# EAGLE design attiny85-5x5x5LEDCube (EAGLE 5.11)
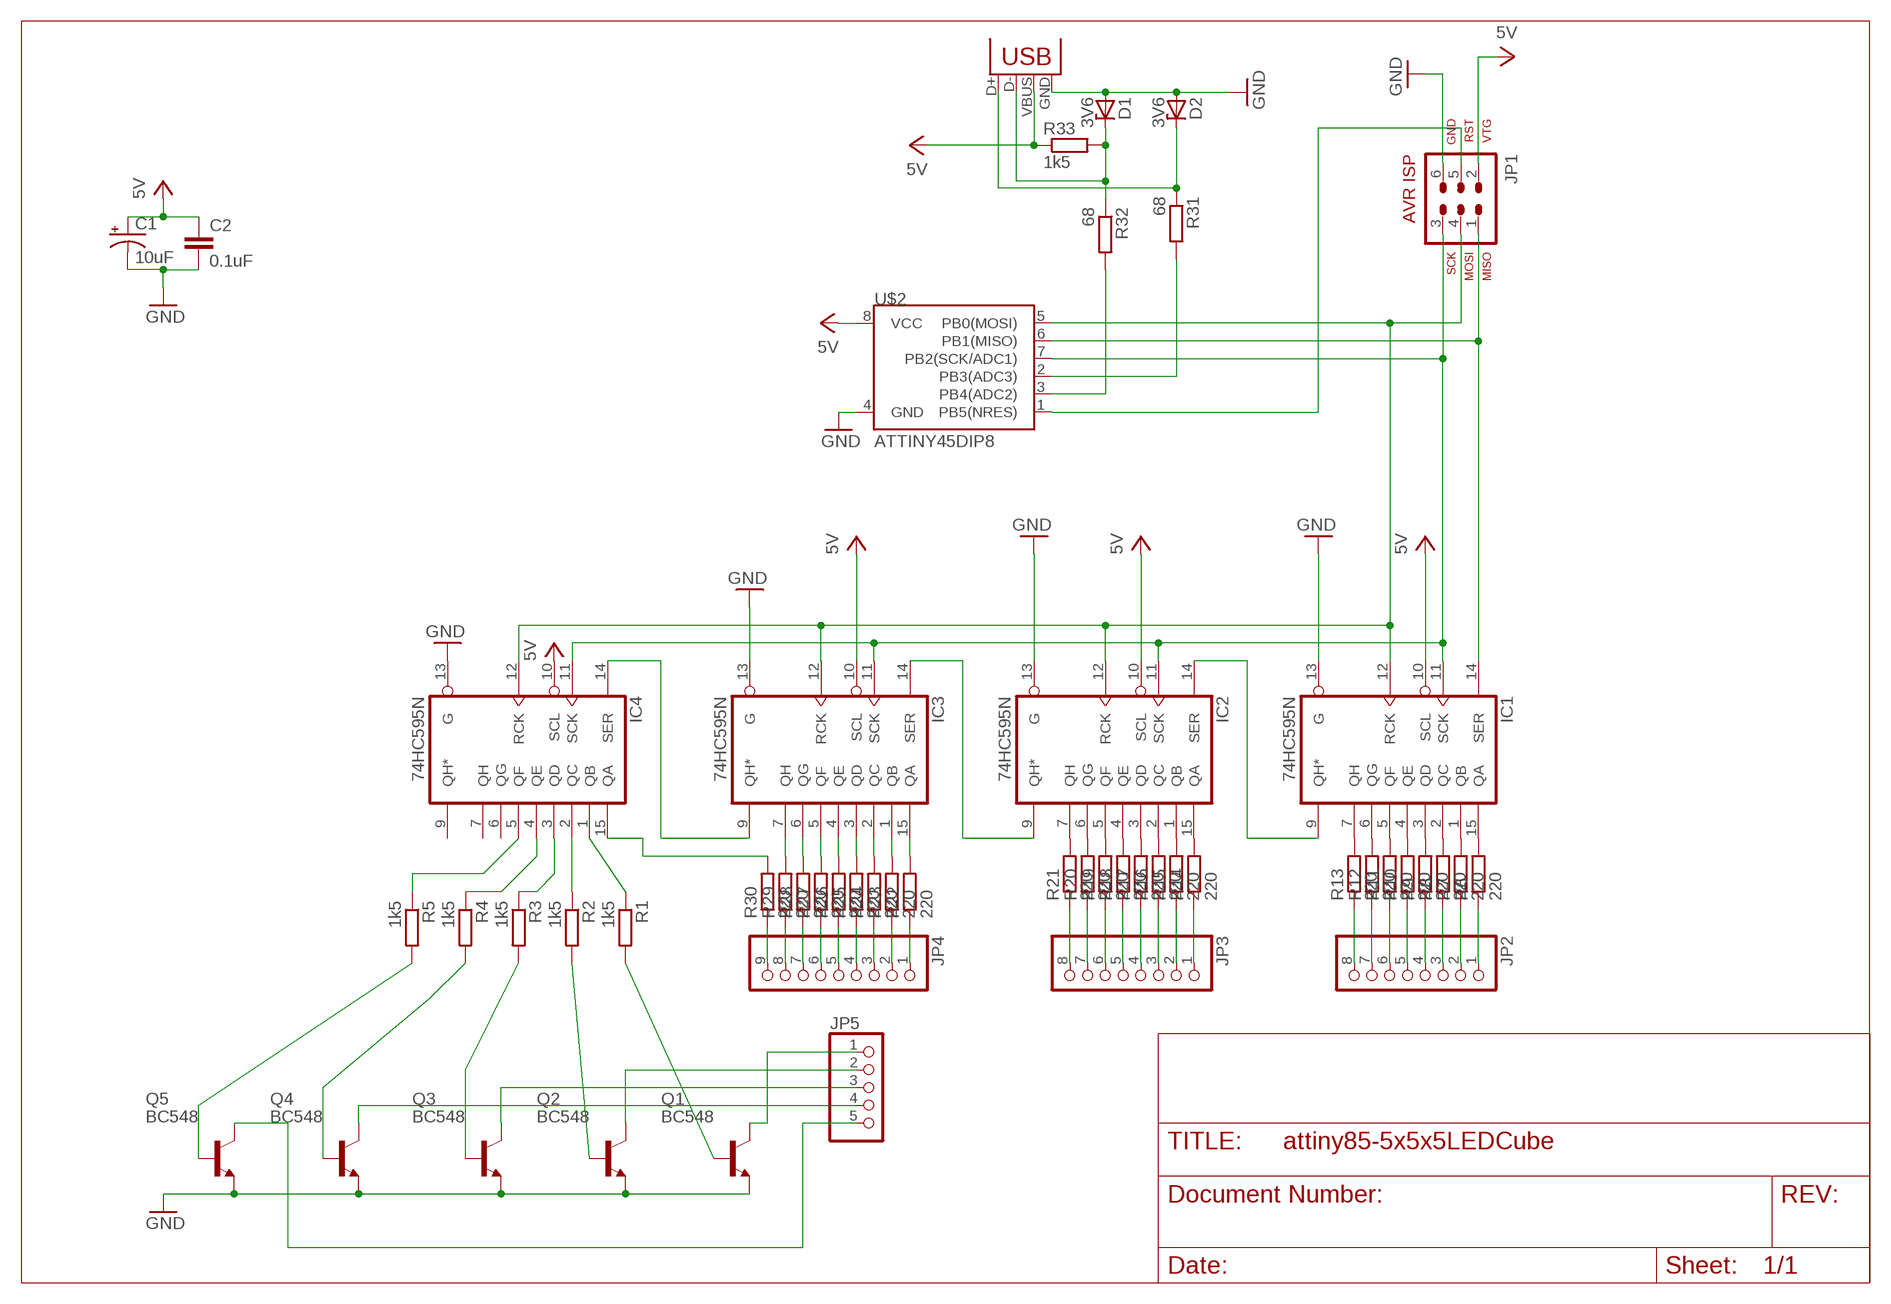
[diagram p0: schematic, sheet 1]

## Parts
C1  10uF  CAP_POLPTH2  [CPOL-RADIAL-10UF-25V]
C2  0.1uF  C-EU050-024X044  [C050-024X044]
D1  3V6  ZENER-DIODEDO34-7  [DO34Z7]
D2  3V6  ZENER-DIODEDO34-7  [DO34Z7]
IC1  74HC595N  [DIL16]
IC2  74HC595N  [DIL16]
IC3  74HC595N  [DIL16]
IC4  74HC595N  [DIL16]
JP1  AVR-ISP-6  [AVR-ISP-6]
JP2  PINHD-1X8  [1X08]
JP3  PINHD-1X8  [1X08]
JP4  PINHD-1X9  [1X09]
JP5  PINHD-1X5  [1X05]
Q1  BC548  [TO92-EBC]
Q2  BC548  [TO92-EBC]
Q3  BC548  [TO92-EBC]
Q4  BC548  [TO92-EBC]
Q5  BC548  [TO92-EBC]
R1  1k5  R-EU_0207/7  [0207/7]
R2  1k5  R-EU_0207/7  [0207/7]
R3  1k5  R-EU_0207/7  [0207/7]
R4  1k5  R-EU_0207/7  [0207/7]
R5  1k5  R-EU_0207/7  [0207/7]
R6  220  R-EU_0207/7  [0207/7]
R7  220  R-EU_0207/7  [0207/7]
R8  220  R-EU_0207/7  [0207/7]
R9  220  R-EU_0207/7  [0207/7]
R10  220  R-EU_0207/7  [0207/7]
R11  220  R-EU_0207/7  [0207/7]
R12  220  R-EU_0207/7  [0207/7]
R13  220  R-EU_0207/7  [0207/7]
R14  220  R-EU_0207/7  [0207/7]
R15  220  R-EU_0207/7  [0207/7]
R16  220  R-EU_0207/7  [0207/7]
R17  220  R-EU_0207/7  [0207/7]
R18  220  R-EU_0207/7  [0207/7]
R19  220  R-EU_0207/7  [0207/7]
R20  220  R-EU_0207/7  [0207/7]
R21  220  R-EU_0207/7  [0207/7]
R22  220  R-EU_0207/7  [0207/7]
R23  220  R-EU_0207/7  [0207/7]
R24  220  R-EU_0207/7  [0207/7]
R25  220  R-EU_0207/7  [0207/7]
R26  220  R-EU_0207/7  [0207/7]
R27  220  R-EU_0207/7  [0207/7]
R28  220  R-EU_0207/7  [0207/7]
R29  220  R-EU_0207/7  [0207/7]
R30  220  R-EU_0207/7  [0207/7]
R31  68  R-EU_0207/7  [0207/7]
R32  68  R-EU_0207/7  [0207/7]
R33  1k5  R-EU_0207/7  [0207/7]
U$2  ATTINY45DIP8  [DIP08]
X1  USBPTH  [USB-B-PTH]

## Nets
GND: C1.2(-) C2.2 D1.A D2.A IC1.13(G) IC2.13(G) IC3.13(G) IC4.13(G) JP1.6 Q1.E Q2.E Q3.E Q4.E Q5.E U$2.4(GND) X1.GND
N$1: Q1.B R1.2
N$2: Q2.B R2.2
N$3: IC4.2(QC) R2.1
N$4: Q3.B R3.2
N$5: Q4.B R4.2
N$6: IC1.15(QA) R6.2
N$7: IC1.1(QB) R7.2
N$8: IC1.2(QC) R8.2
N$9: IC1.3(QD) R9.2
N$10: IC1.4(QE) R10.2
N$11: IC1.5(QF) R11.2
N$12: IC1.6(QG) R12.2
N$13: IC1.7(QH) R13.2
N$14: IC1.12(RCK) IC2.12(RCK) IC3.12(RCK) IC4.12(RCK) JP1.4 U$2.5(PB0(MOSI))
N$15: IC1.14(SER) JP1.1 U$2.6(PB1(MISO))
N$16: IC1.11(SCK) IC2.11(SCK) IC3.11(SCK) IC4.11(SCK) JP1.3 U$2.7(PB2(SCK/ADC1))
N$17: IC2.15(QA) R14.2
N$18: IC2.1(QB) R15.2
N$19: IC2.2(QC) R16.2
N$20: IC2.3(QD) R17.2
N$21: IC2.4(QE) R18.2
N$22: IC2.5(QF) R19.2
N$23: IC2.6(QG) R20.2
N$24: IC2.7(QH) R21.2
N$25: IC3.15(QA) R22.2
N$26: IC3.1(QB) R23.2
N$27: IC3.2(QC) R24.2
N$28: IC3.3(QD) R25.2
N$29: IC3.4(QE) R26.2
N$30: IC3.5(QF) R27.2
N$31: IC3.6(QG) R28.2
N$32: IC3.7(QH) R29.2
N$33: IC4.15(QA) R30.2
N$34: IC1.9(QH*) IC2.14(SER)
N$35: IC2.9(QH*) IC3.14(SER)
N$36: IC3.9(QH*) IC4.14(SER)
N$37: IC4.1(QB) R1.1
N$38: Q5.B R5.2
N$39: IC4.3(QD) R3.1
N$40: IC4.4(QE) R4.1
N$41: IC4.5(QF) R5.1
N$42: JP2.1 R6.1
N$43: R31.2 U$2.2(PB3(ADC3))
N$44: D1.C R32.1 R33.2 X1.D-
N$45: D2.C R31.1 X1.D+
N$46: R32.2 U$2.3(PB4(ADC2))
N$47: JP2.2 R7.1
N$48: JP2.3 R8.1
N$49: JP2.4 R9.1
N$50: JP2.5 R10.1
N$51: JP2.8 R13.1
N$52: JP2.7 R12.1
N$53: JP3.1 R14.1
N$54: JP3.2 R15.1
N$55: JP3.3 R16.1
N$56: JP3.4 R17.1
N$57: JP3.5 R18.1
N$58: JP3.6 R19.1
N$59: JP3.7 R20.1
N$60: JP3.8 R21.1
N$61: JP4.1 R22.1
N$62: JP4.2 R23.1
N$63: JP4.3 R24.1
N$64: JP4.5 R26.1
N$65: JP4.6 R27.1
N$66: JP4.7 R28.1
N$67: JP4.8 R29.1
N$68: JP4.9 R30.1
N$69: JP5.1 Q1.C
N$70: JP5.2 Q2.C
N$71: JP5.3 Q3.C
N$72: JP5.4 Q4.C
N$73: JP5.5 Q5.C
N$74: JP4.4 R25.1
N$75: JP2.6 R11.1
N$76: JP1.5 U$2.1(PB5(NRES))
VCC: C1.1(+) C2.1 IC1.10(SCL) IC2.10(SCL) IC3.10(SCL) IC4.10(SCL) JP1.2 R33.1 U$2.8(VCC) X1.VBUS ; supply symbol labelled 5V
Unconnected: IC4.6(QG) IC4.7(QH) IC4.9(QH*)

## Power pins joined to a net without a drawn wire
GND: IC1.8(GND) IC2.8(GND) IC3.8(GND) IC4.8(GND)
VCC: IC1.16(VCC) IC2.16(VCC) IC3.16(VCC) IC4.16(VCC)

## Library data of the parts
C1 = SparkFun:CAP_POL: Capacitor Polarized These are standard SMD and PTH capacitors. Normally 10uF, 47uF, and 100uF in electrolytic and tantalum varieties. Always verify the external diameter of the through hole cap, it varies with capacity, voltage, and manufacturer. The EIA devices should be standard.
C2 = resistor:C-EU: CAPACITOR, European symbol
D1 D2 = diode:ZENER-DIODE: Z-Diode
IC1-IC4 = 74xx-eu:74*595: 8-bit SHIFT REGISTER, output latch
JP1 = avr-6:AVR-ISP-6: AVR ISP-6 Serial Programming Header
JP2 JP3 = pinhead:PINHD-1X8: PIN HEADER
JP4 = pinhead:PINHD-1X9: PIN HEADER
JP5 = pinhead:PINHD-1X5: PIN HEADER
Q1-Q5 = transistor-npn:BC548*: NPN Transistor
R1-R33 = resistor:R-EU_: RESISTOR, European symbol
U$2 = SparkFun:ATTINY45: Atmel ATTiny45
X1 = SparkFun:USB: USB Connectors USB-B-PTH is fully proven SKU : PRT-00139 USB-miniB is fully proven SKU : PRT-00587 USB-A-PCB is untested. USB-A-H is throughly reviewed, but untested. Spark Fun Electronics SKU : PRT-00437 USB-B-SMT is throughly reviewed, but untested. Needs silkscreen touching up. USB-A-S has not been used/tested USB-MB-H has not been used/tested

## Board
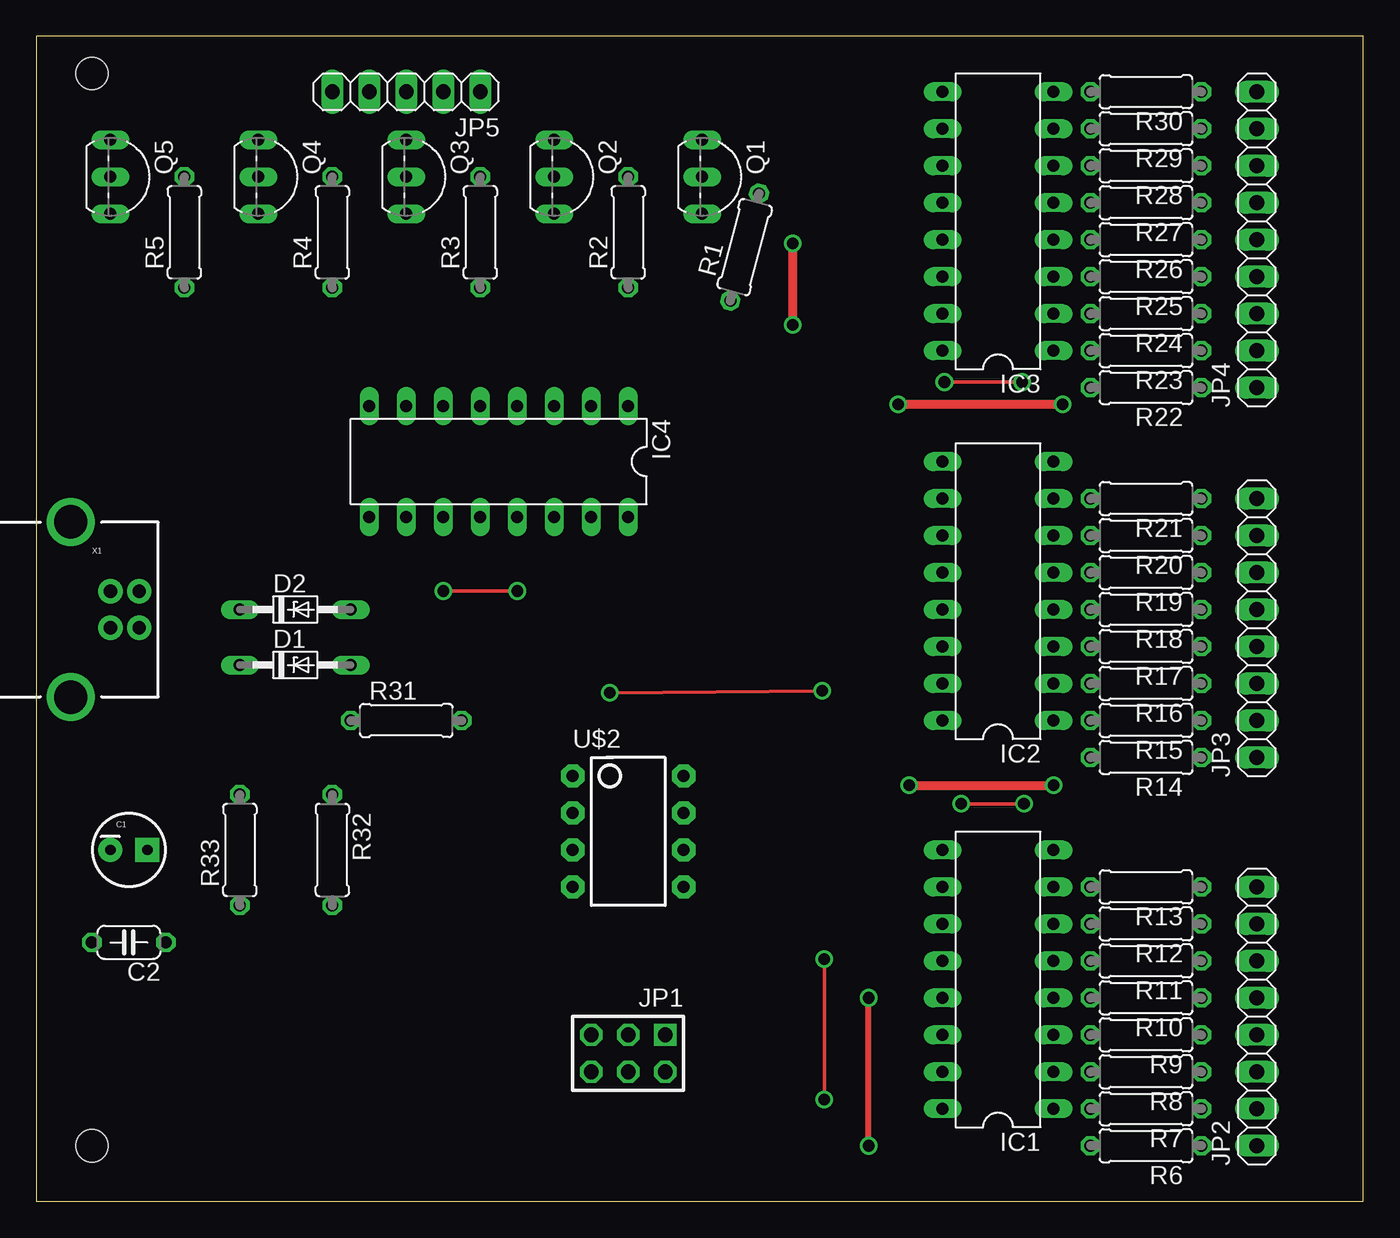
[diagram p1: board, top side]
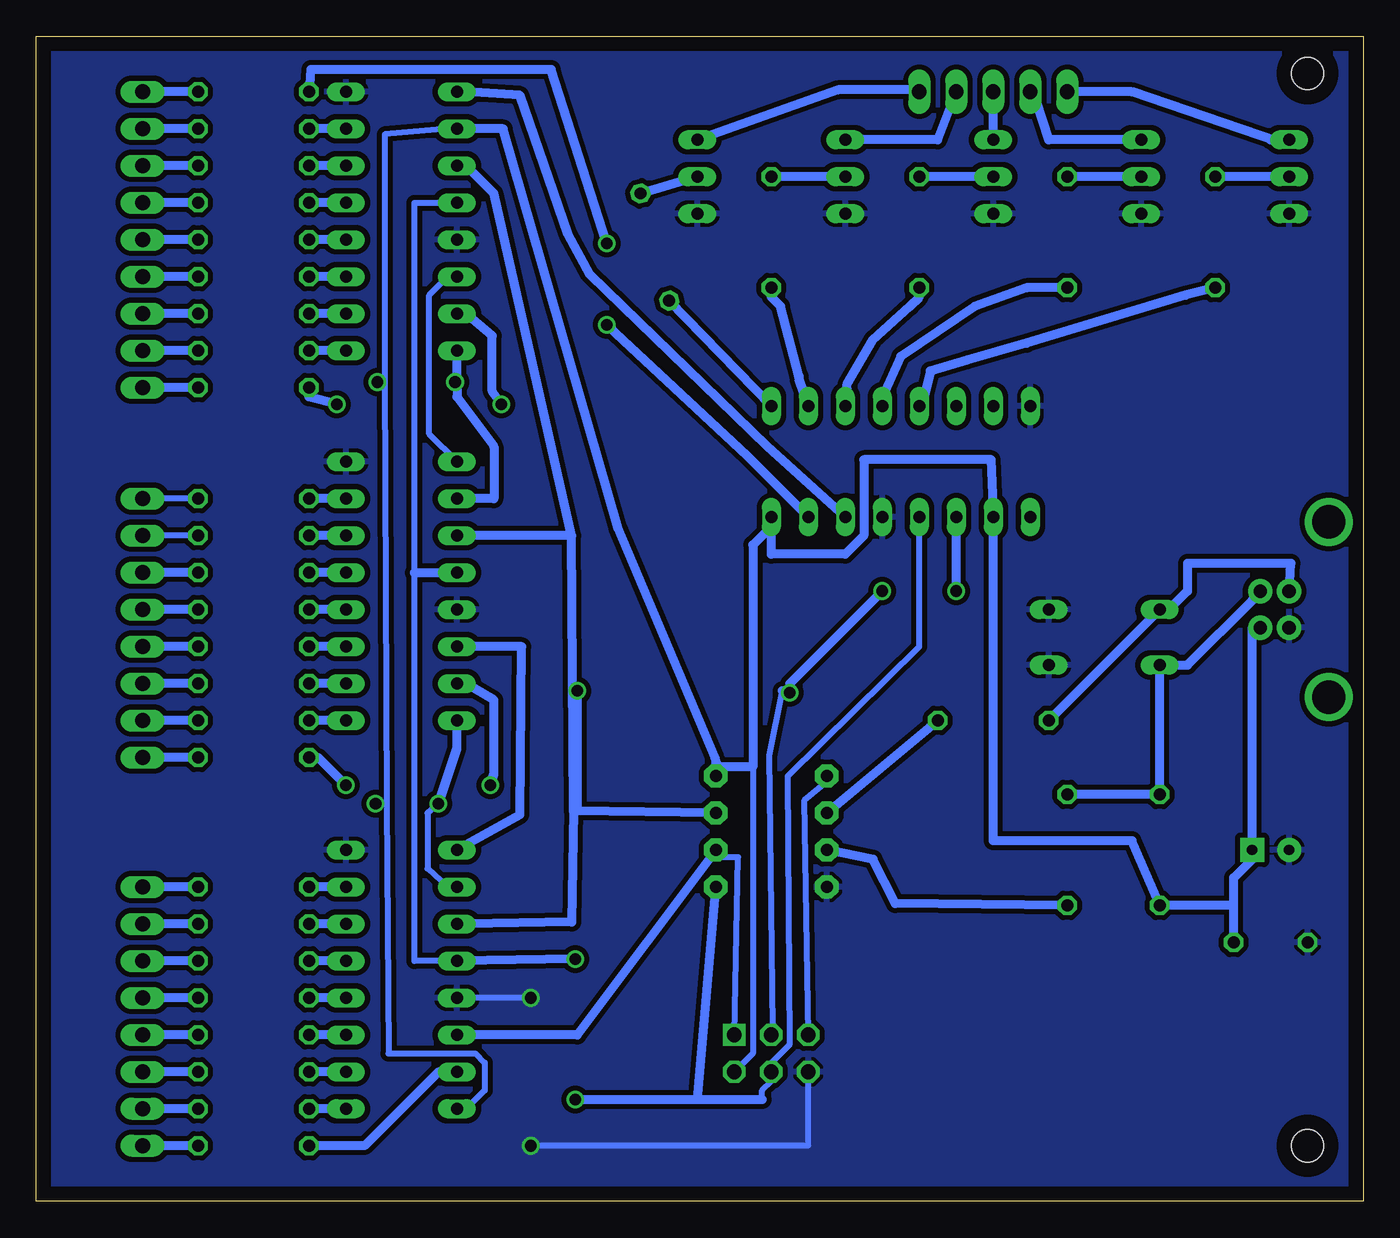
[diagram p2: board, bottom side, seen from below]

Size 91.11 x 80 mm. Coordinates in mm from the lower left corner, seen from the top.
Outline: 0,0 91.11,0 91.11,80 0,80 0,0
Copper layers (1*16): Top 0.035mm / dielectric 1.5mm / Bottom 0.035mm
Design rules "default *": minimum track width 10mil, minimum drill 0.8mm, track to track 0.35mm, track to pad 0.35mm, pad to pad 0.35mm, via to via 0.35mm, smd to smd 0.3mm, copper to edge 40mil, drill to drill 8mil, minimum pad ring 10mil, minimum via ring 8mil, stop-mask expansion 4mil, vias tented up to drill 0mil, thermal gap 10mil
Holes 2.2 mm at 3.81,3.81 3.81,77.47
tRestrict: area 21.6,45.7 to 41.9,55.9; area 12.7,39.4 to 22.9,41.9; area 12.7,35.6 to 22.9,38.1; area 22.9,31.7 to 30.5,34.3; area 19.1,22.9 to 21.6,30.5; area 12.7,22.9 to 15.2,30.5; area 35.6,20.3 to 45.7,30.5; area 61,31.7 to 71.1,52.1; area 72.4,29.2 to 83.8,49.5; area 72.4,2.5 to 83.8,22.9; area 61,5.1 to 71.1,25.4; area 71.1,54.6 to 83.8,77.5; 16 more areas

### Footprints (pad centres in the part's own frame; a part is rotated, then mirrored left to right if it is on the bottom)
CPOL-RADIAL-10UF-25V = drill 0.7 pad 1.651 square: 1 1.27,0 | drill 0.7 pad 1.651 round: 2 -1.27,0
C050-024X044 = drill 0.813 octagon: 1 -2.54,0; 2 2.54,0
DO34Z7 = drill 0.813 long: A 3.81,0; C -3.81,0
DIL16 = drill 0.813 long: 1 -8.89,-3.81; 2 -6.35,-3.81; 3 -3.81,-3.81; 4 -1.27,-3.81; 5 1.27,-3.81; 6 3.81,-3.81; 7 6.35,-3.81; 8 8.89,-3.81; 9 8.89,3.81; 10 6.35,3.81; 11 3.81,3.81; 12 1.27,3.81; 13 -1.27,3.81; 14 -3.81,3.81; 15 -6.35,3.81; 16 -8.89,3.81
AVR-ISP-6 = drill 1.016 square: 1 -2.54,-1.27 | drill 1.016 octagon: 2 -2.54,1.27; 3 0,-1.27; 4 0,1.27; 5 2.54,-1.27; 6 2.54,1.27
1X08 = drill 1.016 long: 1 -8.89,0; 2 -6.35,0; 3 -3.81,0; 4 -1.27,0; 5 1.27,0; 6 3.81,0; 7 6.35,0; 8 8.89,0
1X09 = drill 1.016 long: 1 -10.16,0; 2 -7.62,0; 3 -5.08,0; 4 -2.54,0; 5 0,0; 6 2.54,0; 7 5.08,0; 8 7.62,0; 9 10.16,0
1X05 = drill 1.016 long: 1 -5.08,0; 2 -2.54,0; 3 0,0; 4 2.54,0; 5 5.08,0
TO92-EBC = drill 0.813 long: B 0,-1.27; C -2.54,-1.27; E 2.54,-1.27
0207/7 = drill 0.813 octagon: 1 -3.81,0; 2 3.81,0
DIP08 = drill 0.813 pad 1.6 octagon: 1 -3.81,-3.81; 2 -1.27,-3.81; 3 1.27,-3.81; 4 3.81,-3.81; 5 3.81,3.81; 6 1.27,3.81; 7 -1.27,3.81; 8 -3.81,3.81
USB-B-PTH = drill 0.914 pad 1.676 round: D+ 0,1.25; D- 1.981,1.25; GND 0,-1.25; VBUS 1.981,-1.25 | drill 2.286 round: P$1 -2.718,-6.02; P$2 -2.718,6.02

### Placement (x,y rotation side)
C1  6.35,24.13 0 top
C2  6.35,17.78 180 top
D1  17.78,36.83 0 top
D2  17.78,40.64 0 top
IC1  66.04,15.24 90 top
IC2  66.04,41.91 90 top
IC3  66.04,67.31 90 top
IC4  31.75,50.8 180 top
JP1  40.64,10.16 180 top
JP2  83.82,12.7 90 top
JP3  83.82,39.37 90 top
JP4  83.82,66.04 90 top
JP5  25.4,76.2 180 top
Q1  46.99,70.36 270 top
Q2  36.83,70.36 270 top
Q3  26.67,70.36 270 top
Q4  16.51,70.36 270 top
Q5  6.35,70.36 270 top
R1  48.64,65.53 75 top
R2  40.64,66.55 90 top
R3  30.48,66.55 90 top
R4  20.32,66.55 90 top
R5  10.16,66.55 90 top
R6  76.2,3.81 180 top
R7  76.2,6.35 180 top
R8  76.2,8.89 180 top
R9  76.2,11.43 180 top
R10  76.2,13.97 180 top
R11  76.2,16.51 180 top
R12  76.2,19.05 180 top
R13  76.2,21.59 180 top
R14  76.2,30.48 180 top
R15  76.2,33.02 180 top
R16  76.2,35.56 180 top
R17  76.2,38.1 180 top
R18  76.2,40.64 180 top
R19  76.2,43.18 180 top
R20  76.2,45.72 180 top
R21  76.2,48.26 180 top
R22  76.2,55.88 180 top
R23  76.2,58.42 180 top
R24  76.2,60.96 180 top
R25  76.2,63.5 180 top
R26  76.2,66.04 180 top
R27  76.2,68.58 180 top
R28  76.2,71.12 180 top
R29  76.2,73.66 180 top
R30  76.2,76.2 180 top
R31  25.4,33.02 0 top
R32  20.32,24.13 270 top
R33  13.97,24.13 90 top
U$2  40.64,25.4 270 top
X1  5.08,40.64 0 top

### Tracks (layer width: path | path; a pad name or v marks a point on that pad's centre or on a via)
GND  (via drill 0.8)
  Top 0.406: v57.15,3.81 v57.15,13.97
  Bottom 0.406: v57.15,13.97 IC1.13 | v57.15,3.81 38.1,3.81 JP1.6
  pour Bottom: 0,80.01 0,0 100.33,0 100.33,80.01
N$1
  Bottom 0.61: Q1.B R1.2
N$2
  Bottom 0.61: Q2.B R2.2
N$3
  Bottom 0.61: IC4.2 38.73,56.52 38.73,56.64 40.01,61.47 40.64,62.1 R2.1
N$4
  Bottom 0.61: Q3.B R3.2
N$5
  Bottom 0.61: Q4.B R4.2
N$6
  Bottom 0.61: IC1.15 63.5,8.89 68.58,3.81 R6.2
N$7
  Bottom 0.61: IC1.1 R7.2
N$8
  Bottom 0.61: IC1.2 R8.2
N$9
  Bottom 0.61: IC1.3 R9.2
N$10
  Bottom 0.61: IC1.4 R10.2
N$11
  Bottom 0.61: IC1.5 R11.2
N$12
  Bottom 0.61: IC1.6 R12.2
N$13
  Bottom 0.61: IC1.7 R13.2
N$14  (via drill 0.8)
  Top 0.254: v54.1,6.99 v54.1,16.64
  Bottom 0.254: IC1.12 62.87,16.51 | 40.64,9.53 JP1.4 40.64,8.26
  Bottom 0.406: 62.87,16.51 65.15,16.51 65.15,43.18 65.15,68.58 IC3.12 | IC4.12 30.48,38.1 39.5,29.21 39.37,10.79 40.64,9.53 | 41.27,6.99 41.27,7.62 40.64,8.26
  Bottom 0.61: 65.15,43.18 IC2.12 | 45.72,6.99 U$2.5 | 41.27,6.99 45.72,6.99 | v54.1,16.64 IC1.12 | 45.72,6.99 v54.1,6.99
N$15
  Bottom 0.406: JP1.1 42.93,23.62 44.58,23.62
  Bottom 0.61: IC1.14 53.98,11.43 U$2.6 44.58,23.62
N$16  (via drill 0.8)
  Top 0.254: v33.02,41.91 v27.94,41.91 | v39.37,34.92 v53.98,35.05
  Bottom 0.254: 61.59,19.05 IC1.11 | 61.59,71.12 IC3.11 | v39.37,34.92 39.37,35.56 | 40.51,11.94 40.64,12.06 JP1.3 | 53.98,26.92 44.45,26.8 U$2.7
  Bottom 0.406: 40.51,11.94 40.77,30.61 39.88,35.05
  Bottom 0.61: 61.59,19.05 54.36,19.18 54.23,26.8 | 54.23,26.8 54.36,45.72 | 54.36,45.72 IC2.11 | 61.59,71.12 59.69,69.22 54.36,45.72 | U$2.7 54.23,26.8 | v27.94,41.91 IC4.11 | 39.37,35.56 v33.02,41.91 | 39.88,35.05 v39.37,34.92 | v53.98,35.05 53.98,26.92
N$17  (via drill 0.8)
  Top 0.61: v59.94,28.57 v69.85,28.57
  Bottom 0.61: IC2.15 61.59,35.56 59.69,34.42 59.69,29.34 v59.94,28.57 | v69.85,28.57 71.75,30.48 R14.2
N$18
  Bottom 0.61: IC2.1 R15.2
N$19
  Bottom 0.61: IC2.2 R16.2
N$20
  Bottom 0.61: IC2.3 R17.2
N$21
  Bottom 0.61: IC2.4 R18.2
N$22
  Bottom 0.61: IC2.5 R19.2
N$23
  Bottom 0.61: IC2.6 R20.2
N$24
  Bottom 0.61: IC2.7 R21.2
N$25  (via drill 0.8)
  Top 0.61: v59.18,54.74 v70.48,54.74
  Bottom 0.254: 72.39,55.24 R22.2
  Bottom 0.61: IC3.15 61.59,60.96 59.82,59.44 59.82,55.63 v59.18,54.74 | v70.48,54.74 72.39,55.24
N$26
  Bottom 0.61: IC3.1 R23.2
N$27
  Bottom 0.61: IC3.2 R24.2
N$28
  Bottom 0.61: IC3.3 R25.2
N$29
  Bottom 0.61: IC3.4 R26.2
N$30
  Bottom 0.61: IC3.5 R27.2
N$31
  Bottom 0.61: IC3.6 R28.2
N$32
  Bottom 0.61: IC3.7 R29.2
N$33  (via drill 0.8)
  Top 0.61: v51.94,60.2 v51.94,65.79
  Bottom 0.61: IC4.15 42.29,51.18 51.82,60.07 v51.94,60.2 | v51.94,65.79 55.75,77.72 72.26,77.72 R30.2
N$34
  Bottom 0.254: IC2.14 62.87,38.1
  Bottom 0.61: IC1.9 57.91,26.54 57.78,38.1 IC2.14
N$35
  Bottom 0.254: 62.87,63.5 IC3.14
  Bottom 0.406: IC2.9 64.14,52.7 64.14,62.23 62.87,63.5
N$36
  Bottom 0.254: 61.59,76.2 IC3.9
  Bottom 0.61: IC4.14 40.89,51.82 53.09,63.63 54.61,66.42 57.91,75.95 61.59,76.2
N$37
  Bottom 0.61: IC4.1 R1.1
N$38
  Bottom 0.61: Q5.B R5.2
N$39
  Bottom 0.61: IC4.3 35.43,55.75 35.43,56.13 33.66,59.18 31.11,61.47 30.48,62.1 R3.1
N$40
  Bottom 0.61: R4.1 23.11,62.74 26.67,61.47 31.75,58.04 33.02,55.24
  Bottom 0.813: 33.02,55.24 IC4.4
N$41
  Bottom 0.254: 30.48,53.98 IC4.5
  Bottom 0.61: R5.1 12.19,62.23 23.11,58.93 27.18,57.78 29.72,57.02 30.48,53.98
N$42
  Bottom 0.61: R6.1 JP2.1
N$43
  Bottom 0.61: U$2.2 R31.2
N$44
  Bottom 0.61: R32.1 R33.2 D1.C 12.06,36.83 7.62,41.27 X1.D-
N$45
  Bottom 0.254: 13.34,40.64 D2.C | X1.D+ 5.08,41.91
  Bottom 0.61: D2.C R31.1 | 5.08,41.91 4.95,43.81 12.06,43.81 12.06,41.91 13.34,40.64
N$46
  Bottom 0.61: R32.2 32.13,20.45 33.66,23.5 U$2.3
N$47
  Bottom 0.61: R7.1 JP2.2
N$48
  Bottom 0.61: R8.1 JP2.3
N$49
  Bottom 0.61: R9.1 JP2.4
N$50
  Bottom 0.61: R10.1 JP2.5
N$51
  Bottom 0.406: JP2.8 85.09,21.59
  Bottom 0.61: R13.1 JP2.8
N$52
  Bottom 0.61: R12.1 JP2.7
N$53
  Bottom 0.61: R14.1 JP3.1
N$54
  Bottom 0.61: R15.1 JP3.2
N$55
  Bottom 0.61: R16.1 JP3.3
N$56
  Bottom 0.61: R17.1 JP3.4
N$57
  Bottom 0.61: R18.1 JP3.5
N$58
  Bottom 0.61: R19.1 JP3.6
N$59
  Bottom 0.406: R20.1 JP3.7
N$60
  Bottom 0.406: R21.1 JP3.8
N$61
  Bottom 0.61: R22.1 JP4.1
N$62
  Bottom 0.61: R23.1 JP4.2
N$63
  Bottom 0.61: R24.1 JP4.3
N$64
  Bottom 0.61: R26.1 JP4.5
N$65
  Bottom 0.61: R27.1 JP4.6
N$66
  Bottom 0.406: JP4.7 85.09,71.12
  Bottom 0.61: R28.1 JP4.7
N$67
  Bottom 0.61: R29.1 JP4.8
N$68
  Bottom 0.61: R30.1 JP4.9
N$69
  Bottom 0.61: Q1.C 36.07,76.33 30.99,76.33 JP5.1
N$70
  Bottom 0.61: Q2.C 29.21,72.9 JP5.2
N$71
  Bottom 0.61: Q3.C JP5.3
N$72
  Bottom 0.254: 22.86,76.83 JP5.4
  Bottom 0.61: Q4.C 21.59,72.9 22.86,76.83
N$73
  Bottom 0.254: 6.35,72.9 5.84,72.77
  Bottom 0.61: Q5.C 6.35,72.9 | 5.84,72.77 15.88,76.2 JP5.5
N$74
  Bottom 0.61: R25.1 JP4.4
N$75
  Bottom 0.61: R11.1 JP2.6
N$76
  Bottom 0.406: JP1.5 38.35,27.56 36.83,28.83 U$2.1
VCC  (via drill 0.8)
  Top 0.254: v67.69,56.26 v62.36,56.26 | v67.82,27.3 v63.5,27.3
  Bottom 0.254: IC3.10 62.87,73.66 | v62.36,56.26 62.23,56.52 | 67.18,56.64 v67.69,56.26 | 67.06,27.3 v67.82,27.3 | 7.62,23.5 C1.1 | IC4.10 25.4,47.75 | 43.94,29.84 44.45,30.48 44.52,30.47
  Bottom 0.406: IC1.10 62.87,21.59 64.26,22.86 64.26,26.67 v63.5,27.3 | IC1.16 61.59,6.35 60.33,7.62 60.33,9.53 60.96,10.16 66.93,10.16 67.06,27.3 67.18,56.64 67.18,73.28 62.87,73.66 | JP1.2 41.91,10.16 41.91,29.84
  Bottom 0.61: v63.5,27.3 62.23,31.11 IC2.16 | IC2.10 59.69,48.26 59.69,51.82 62.23,55.24 62.23,56.52 IC3.16 | 8.89,20.32 8.89,22.23 7.62,23.5 | C2.1 8.89,20.32 | 8.89,20.32 R33.1 15.88,24.77 25.4,24.77 IC4.10 | C1.1 7.62,39.37 X1.VBUS | IC3.10 59.05,73.66 51.18,46.23 44.52,30.47 44.45,29.84 U$2.8 | 25.4,47.75 25.53,50.93 34.29,50.93 34.29,45.72 35.56,44.45 40.64,44.45 40.64,46.35 | 40.64,46.35 41.91,45.09 41.91,29.84 43.94,29.84 | 40.64,46.35 IC4.16